# Altium project oled_control.PrjPCB
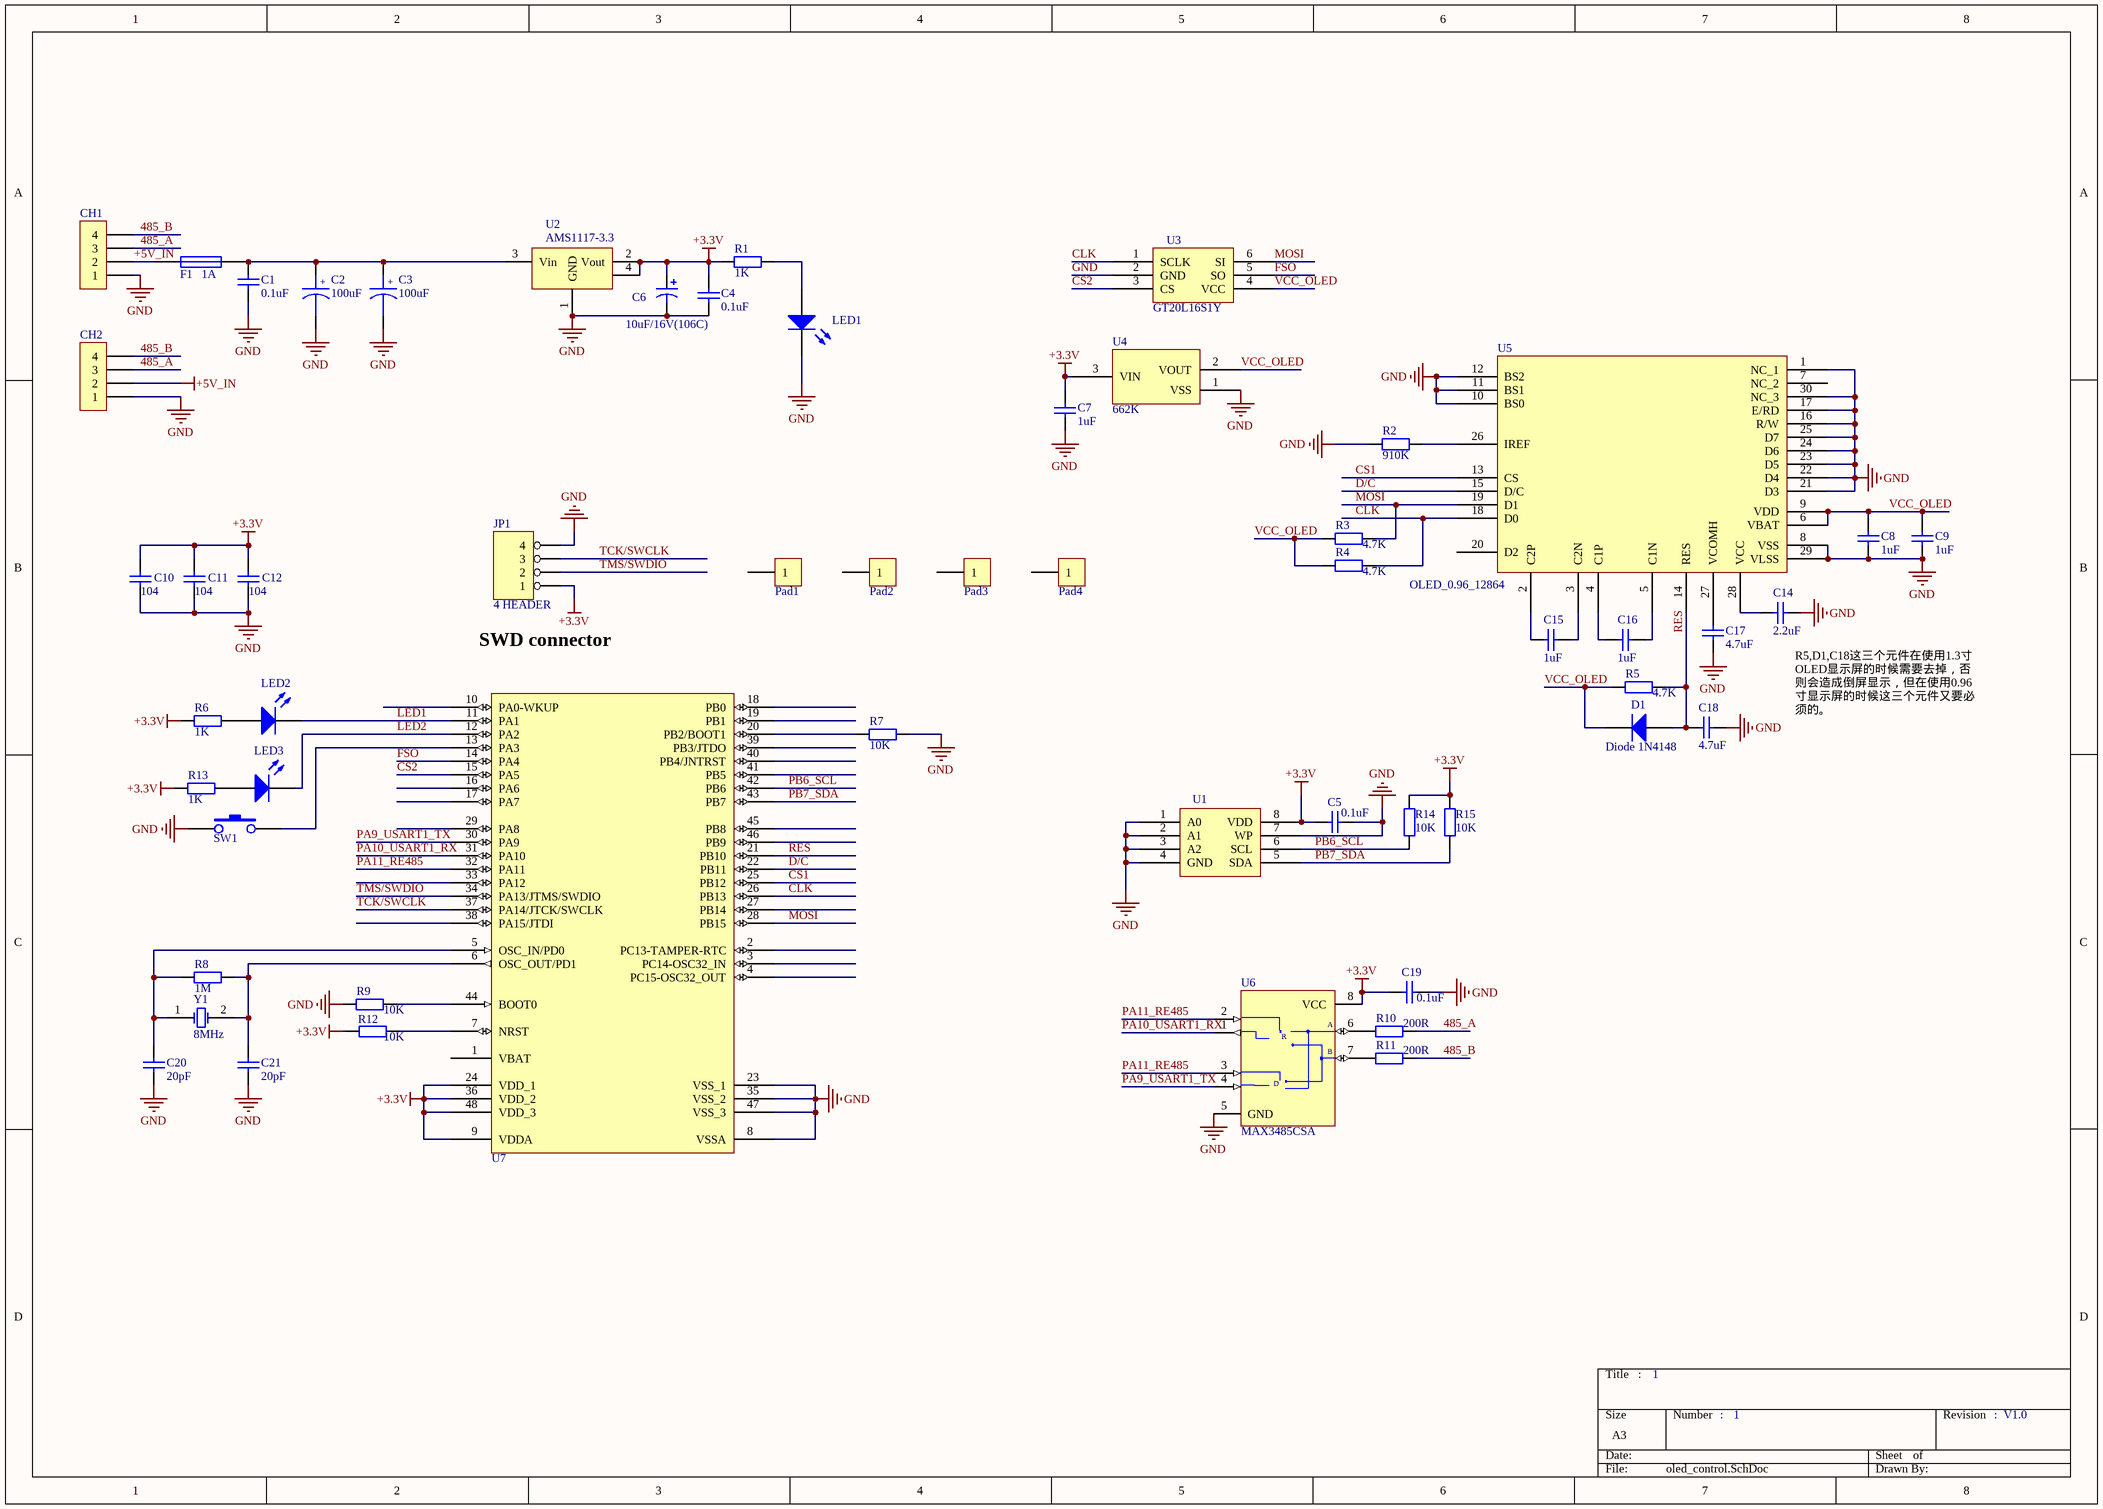
[diagram p0: oled_control.SchDoc]
1 sheet, 56 parts. Net scope: global (net labels, ports and power ports of the same name join across sheets).
Board file: oled_control.PcbDoc

## Sheet oled_control.SchDoc
size A3; DocumentNumber: 1; Revision: V1.0; SheetNumber: 1; SheetTotal: 1; Rule: PcbType=ProtelPcb

### Parts
C1  value 0.1uF  [0805]  (hidden comment: Cap)
C2  C_2200uF  [B: 3528]  (value not drawn)
C3  C_2200uF  [B: 3528]  (value not drawn)
C4  value 0.1uF  [0805]  (hidden comment: Cap)
C5  value 0.1uF  [0805]  (hidden comment: Cap)
C6  value 10uF/16V(106C)  [CAP A-3216]  (hidden comment: Cap Pol3)
C7  value 1uF  [0805]  (hidden comment: Cap)
C8  value 1uF  [0805]  (hidden comment: Cap)
C9  value 1uF  [0805]  (hidden comment: Cap)
C10  value 104  [0805]  (hidden comment: Cap)
C11  value 104  [0805]  (hidden comment: Cap)
C12  value 104  [0805]  (hidden comment: Cap)
C14  value 2.2uF  [0805]  (hidden comment: Cap)
C15  value 1uF  [0805]  (hidden comment: Cap)
C16  value 1uF  [0805]  (hidden comment: Cap)
C17  value 4.7uF  [0805]  (hidden comment: Cap)
C18  value 4.7uF  [0805]  (hidden comment: Cap)
C19  value 0.1uF  [0805]  (hidden comment: Cap)
C20  value 20pF  [0805]  (hidden comment: Cap)
C21  value 20pF  [0805]  (hidden comment: Cap)
CH1  HEADER1X4  [CON4_1.5]  (value not drawn)
CH2  HEADER1X4  [CON4_1.5]  (value not drawn)
D1  Diode 1N4148  [LL34]
F1  FUSE  [0805]  (value not drawn)
JP1  4 HEADER  [CON4_1.5]
LED1  (no value)  [LED-0805]
LED2  (no value)  [LED-0805]
LED3  (no value)  [LED_5X5]
Pad1  Pad  [pad35]  (value not drawn)
Pad2  Pad  [pad35]  (value not drawn)
Pad3  Pad  [pad35]  (value not drawn)
Pad4  Pad  [pad35]  (value not drawn)
R1  value 1K  [0805]  (hidden comment: Res2)
R2  value 910K  [0805]  (hidden comment: Res2)
R3  value 4.7K  [0805]  (hidden comment: Res2)
R4  value 4.7K  [0805]  (hidden comment: Res2)
R5  value 4.7K  [0805]  (hidden comment: Res2)
R6  value 1K  [0805]  (hidden comment: Res2)
R7  value 10K  [0805]  (hidden comment: Res2)
R8  value 1M  [0805]  (hidden comment: Res2)
R9  value 10K  [0805]  (hidden comment: Res2)
R10  value 200R  [0805]  (hidden comment: Res2)
R11  value 200R  [0805]  (hidden comment: Res2)
R12  value 10K  [0805]  (hidden comment: Res2)
R13  value 1K  [0805]  (hidden comment: Res2)
R14  value 10K  [C0805tan]  (hidden comment: Res2)
R15  value 10K  [C0805tan]  (hidden comment: Res2)
SW1  SW-KEY-2  [KEY_SOP4X4]  (value not drawn)
U1  AT24c02  [TSSOP8]  (value not drawn)
U2  AMS1117-3.3  [SOT223]
U3  GT20L16S1Y  [SOT23-6]
U4  662K  [SOT-23]
U5  OLED_0.96_12864  [OLED_1.30_12864]
U6  MAX3485CSA  [NS08-L]
U7  STM32F103C8T6  [LQFP48]  (value not drawn)
Y1  8MHz  [XTAL_US1]

### Nets
+3.3V: C4.2 C5.2 C6.1 C7.1 C10.2 C11.2 C12.2 C19.1 JP1.1 R1.2 R6.2 R12.1 R13.2 R14.2 R15.2 U1.8(VDD) U2.2(Vout) U2.4 U4.3(VIN) U6.8(VCC) U7.9(VDDA) U7.24(VDD_1) U7.36(VDD_2) U7.48(VDD_3)
+5V_IN: CH1.2 CH2.2 F1.1
GND: C1.1 C2.2 C3.2 C4.1 C5.1 C6.2 C7.2 C8.2 C9.2 C10.1 C11.1 C12.1 C14.1 C17.2 C18.1 C19.2 C20.1 C21.1 CH1.1 CH2.1 JP1.4 LED1.2(K) R2.2 R7.2 R9.1 SW1.1 U1.1(A0) U1.2(A1) U1.3(A2) U1.4(GND) U1.7(WP) U2.1(GND) U3.2(GND) U4.1(VSS) U5.1(NC_1) U5.8(VSS) U5.10(BS0) U5.11(BS1) U5.12(BS2) U5.16(R/W) U5.17(E/RD) U5.21(D3) U5.22(D4) U5.23(D5) U5.24(D6) U5.25(D7) U5.29(VLSS) U5.30(NC_3) U6.5(GND) U7.8(VSSA) U7.23(VSS_1) U7.35(VSS_2) U7.47(VSS_3)
485_A: CH1.3 CH2.3 R10.2
485_B: CH1.4 CH2.4 R11.2
CLK: R4.1 U3.1(SCLK) U5.18(D0) U7.26(PB13)
CS1: U5.13(CS) U7.25(PB12)
CS2: U3.3(CS) U7.15(PA5)
D/C: U5.15(D/C) U7.22(PB11)
FSO: U3.5(SO) U7.14(PA4)
LED1: LED2.2(K) U7.11(PA1)
LED2: LED3.2(K) U7.12(PA2)
MOSI: R3.1 U3.6(SI) U5.19(D1) U7.28(PB15)
PA9_USART1_TX: U6.4(DI) U7.30(PA9)
PA10_USART1_RX: U6.1(RO) U7.31(PA10)
PA11_RE485: U6.2(~{RE}) U6.3(DE) U7.32(PA11)
PB6_SCL: R14.1 U1.6(SCL) U7.42(PB6)
PB7_SDA: R15.1 U1.5(SDA) U7.43(PB7)
RES: C18.2 D1.1(A) R5.1 U5.14(RES) U7.21(PB10)
TCK/SWCLK: JP1.3 U7.37(PA14/JTCK/SWCLK)
TMS/SWDIO: JP1.2 U7.34(PA13/JTMS/SWDIO)
VCC_OLED: C8.1 C9.1 D1.2(K) R3.2 R4.2 R5.2 U3.4(VCC) U4.2(VOUT) U5.6(VBAT) U5.9(VDD)
NetC1_2: C1.2 C2.1 C3.1 F1.2 U2.3(Vin)
NetC14_2: C14.2 U5.28(VCC)
NetC15_1: C15.1 U5.3(C2N)
NetC15_2: C15.2 U5.2(C2P)
NetC16_1: C16.1 U5.5(C1N)
NetC16_2: C16.2 U5.4(C1P)
NetC17_1: C17.1 U5.27(VCOMH)
NetC20_2: C20.2 R8.1 U7.5(OSC_IN/PD0) Y1.1(OSC1)
NetC21_2: C21.2 R8.2 U7.6(OSC_OUT/PD1) Y1.2(OSC2)
NetLED1_1: LED1.1(A) R1.1
NetLED2_1: LED2.1(A) R6.1
NetLED3_1: LED3.1(A) R13.1
NetR2_1: R2.1 U5.26(IREF)
NetR7_1: R7.1 U7.20(PB2/BOOT1)
NetR9_2: R9.2 U7.44(BOOT0)
NetR10_1: R10.1 U6.6(A)
NetR11_1: R11.1 U6.7(B)
NetR12_2: R12.2 U7.7(NRST)
NetSW1_2: SW1.2 U7.13(PA3)

Not connected (* = marked no-connect by the designer): Pad1 1; Pad2 1; Pad3 1; Pad4 1; U5 7(NC_2) 20(D2); U7 1(VBAT) 2(PC13-TAMPER-RTC) 3(PC14-OSC32_IN) 4(PC15-OSC32_OUT) 10(PA0-WKUP) 16(PA6) 17(PA7) 18(PB0) 19(PB1) 27(PB14) 29(PA8) 33(PA12) 38(PA15/JTDI) 39(PB3/JTDO) 40(PB4/JNTRST) 41(PB5) 45(PB8) 46(PB9)

### Notes on the sheet
- SWD connector
- (near C14) R5,D1,C18这三个元件在使用1.3寸OLED显示屏的时候需要去掉，否则会造成倒屏显示，但在使用0.96寸显示屏的时候这三个元件又要必须的。
- :
- (in symbol C_2200uF) +; 100uF
- (in symbol FUSE) 1A
- (in symbol MAX485CSA) R; D

### Library data of the parts
C1 C4 C5 C7-C12 C14-C21 = Cap: Capacitor; Published: 8-Jun-2000; LatestRevisionDate: 17-Jul-2002; LatestRevisionNote: Re-released for DXP Platform.; Publisher: Altium Limited
  C1 C4 C5 C7-C12 C14-C19: PackageReference: RAD-0.3
C6 = Cap Pol3: Polarized Capacitor (Surface Mount); Published: 8-Jun-2000; LatestRevisionDate: 17-Jul-2002; LatestRevisionNote: Re-released for DXP Platform.; PackageReference: C0805; Publisher: Altium Limited
D1 = Diode 1N4148: High Conductance Fast Diode; Published: 8-Jun-2000; LatestRevisionDate: 17-Jul-2002; LatestRevisionNote: Re-released for DXP Platform.; DatasheetDocument: 1997; PackageReference: DO-35; Publisher: Altium Limited; Code_JEDEC: DO-204-AH; ComponentLink1Description: Manufacturer Link; ComponentLink1URL: http://www.fairchildsemi.com/; ComponentLink2Description: Datasheet; ComponentLink2URL: http://www.fairchildsemi.com/ds/1N%2F1N4148.pdf
JP1 = 4 HEADER: 4 Pin Header
LED1-LED3 = LED2: Typical RED, GREEN, YELLOW, AMBER GaAs LED; Published: 8-Jun-2000; LatestRevisionDate: 17-Jul-2002; LatestRevisionNote: Re-released for DXP Platform.; PackageDocument: Feb-2002; PackageReference: 3.2X1.6X1.1; Publisher: Altium Limited
R1-R15 = Res2: Resistor; Published: 8-Jun-2000; LatestRevisionDate: 17-Jul-2002; LatestRevisionNote: Re-released for DXP Platform.; Publisher: Altium Limited
  R1-R6 R10 R11 R13-R15: PackageReference: AXIAL-0.4
U1 = TI24c02
U2 = AMS1117-5
U6 = MAX485CSA
Y1 = XTAL: Crystal Oscillator; Published: 8-Jun-2000; LatestRevisionDate: 17-Jul-2002; LatestRevisionNote: Re-released for DXP Platform.; Publisher: Altium Limited